# Altium schematic sheet Solenoid and Flasher Driver.SchDoc
size A3 portrait; Organization: Altium Limited; Address1: L3, 12a Rodborough Rd; Address2: Frenchs Forest; Address3: NSW; Address4: Australia 2086
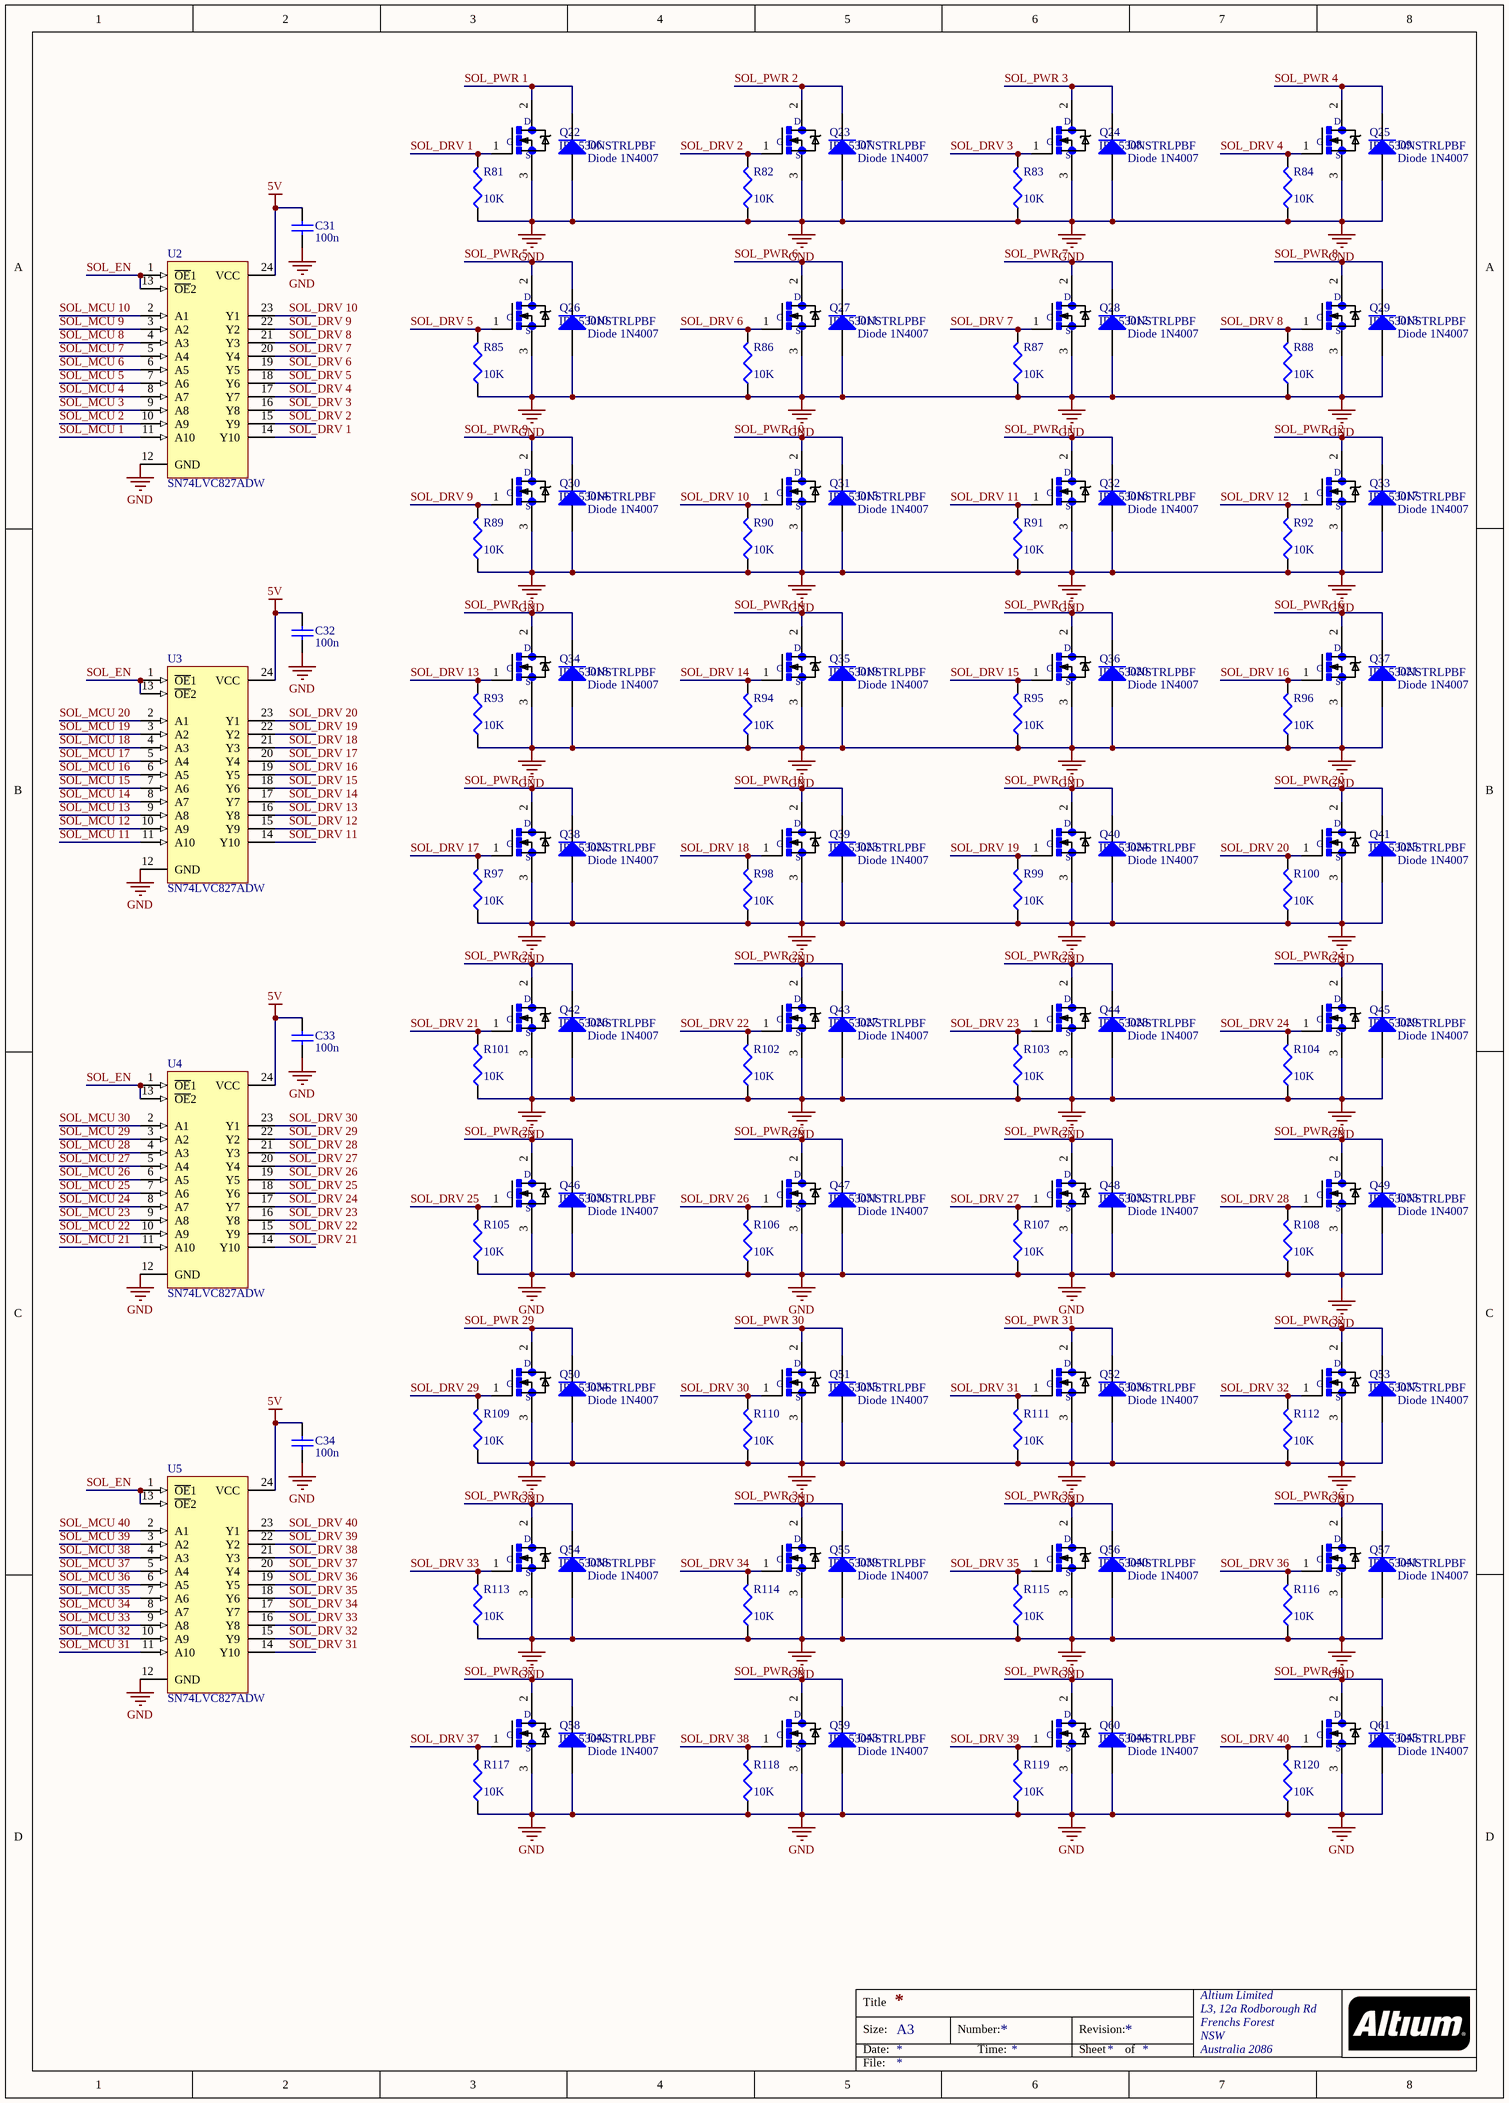
[diagram p0: Solenoid and Flasher Driver.SchDoc]

## Parts
C31  value 100n  [0805C-GENERIC]  (hidden comment: Cap Semi)
C32  value 100n  [0805C-GENERIC]  (hidden comment: Cap Semi)
C33  value 100n  [0805C-GENERIC]  (hidden comment: Cap Semi)
C34  value 100n  [0805C-GENERIC]  (hidden comment: Cap Semi)
D6  Diode 1N4007  [DO-41]
D7  Diode 1N4007  [DO-41]
D8  Diode 1N4007  [DO-41]
D9  Diode 1N4007  [DO-41]
D10  Diode 1N4007  [DO-41]
D11  Diode 1N4007  [DO-41]
D12  Diode 1N4007  [DO-41]
D13  Diode 1N4007  [DO-41]
D14  Diode 1N4007  [DO-41]
D15  Diode 1N4007  [DO-41]
D16  Diode 1N4007  [DO-41]
D17  Diode 1N4007  [DO-41]
D18  Diode 1N4007  [DO-41]
D19  Diode 1N4007  [DO-41]
D20  Diode 1N4007  [DO-41]
D21  Diode 1N4007  [DO-41]
D22  Diode 1N4007  [DO-41]
D23  Diode 1N4007  [DO-41]
D24  Diode 1N4007  [DO-41]
D25  Diode 1N4007  [DO-41]
D26  Diode 1N4007  [DO-41]
D27  Diode 1N4007  [DO-41]
D28  Diode 1N4007  [DO-41]
D29  Diode 1N4007  [DO-41]
D30  Diode 1N4007  [DO-41]
D31  Diode 1N4007  [DO-41]
D32  Diode 1N4007  [DO-41]
D33  Diode 1N4007  [DO-41]
D34  Diode 1N4007  [DO-41]
D35  Diode 1N4007  [DO-41]
D36  Diode 1N4007  [DO-41]
D37  Diode 1N4007  [DO-41]
D38  Diode 1N4007  [DO-41]
D39  Diode 1N4007  [DO-41]
D40  Diode 1N4007  [DO-41]
D41  Diode 1N4007  [DO-41]
D42  Diode 1N4007  [DO-41]
D43  Diode 1N4007  [DO-41]
D44  Diode 1N4007  [DO-41]
D45  Diode 1N4007  [DO-41]
Q22  IRL530NSTRLPBF  [TO-220AB]
Q23  IRL530NSTRLPBF  [TO-220AB]
Q24  IRL530NSTRLPBF  [TO-220AB]
Q25  IRL530NSTRLPBF  [TO-220AB]
Q26  IRL530NSTRLPBF  [TO-220AB]
Q27  IRL530NSTRLPBF  [TO-220AB]
Q28  IRL530NSTRLPBF  [TO-220AB]
Q29  IRL530NSTRLPBF  [TO-220AB]
Q30  IRL530NSTRLPBF  [TO-220AB]
Q31  IRL530NSTRLPBF  [TO-220AB]
Q32  IRL530NSTRLPBF  [TO-220AB]
Q33  IRL530NSTRLPBF  [TO-220AB]
Q34  IRL530NSTRLPBF  [TO-220AB]
Q35  IRL530NSTRLPBF  [TO-220AB]
Q36  IRL530NSTRLPBF  [TO-220AB]
Q37  IRL530NSTRLPBF  [TO-220AB]
Q38  IRL530NSTRLPBF  [TO-220AB]
Q39  IRL530NSTRLPBF  [TO-220AB]
Q40  IRL530NSTRLPBF  [TO-220AB]
Q41  IRL530NSTRLPBF  [TO-220AB]
Q42  IRL530NSTRLPBF  [TO-220AB]
Q43  IRL530NSTRLPBF  [TO-220AB]
Q44  IRL530NSTRLPBF  [TO-220AB]
Q45  IRL530NSTRLPBF  [TO-220AB]
Q46  IRL530NSTRLPBF  [TO-220AB]
Q47  IRL530NSTRLPBF  [TO-220AB]
Q48  IRL530NSTRLPBF  [TO-220AB]
Q49  IRL530NSTRLPBF  [TO-220AB]
Q50  IRL530NSTRLPBF  [TO-220AB]
Q51  IRL530NSTRLPBF  [TO-220AB]
Q52  IRL530NSTRLPBF  [TO-220AB]
Q53  IRL530NSTRLPBF  [TO-220AB]
Q54  IRL530NSTRLPBF  [TO-220AB]
Q55  IRL530NSTRLPBF  [TO-220AB]
Q56  IRL530NSTRLPBF  [TO-220AB]
Q57  IRL530NSTRLPBF  [TO-220AB]
Q58  IRL530NSTRLPBF  [TO-220AB]
Q59  IRL530NSTRLPBF  [TO-220AB]
Q60  IRL530NSTRLPBF  [TO-220AB]
Q61  IRL530NSTRLPBF  [TO-220AB]
R81  value 10K  [0805R-GENERIC]  (hidden comment: Res3)
R82  value 10K  [0805R-GENERIC]  (hidden comment: Res3)
R83  value 10K  [0805R-GENERIC]  (hidden comment: Res3)
R84  value 10K  [0805R-GENERIC]  (hidden comment: Res3)
R85  value 10K  [0805R-GENERIC]  (hidden comment: Res3)
R86  value 10K  [0805R-GENERIC]  (hidden comment: Res3)
R87  value 10K  [0805R-GENERIC]  (hidden comment: Res3)
R88  value 10K  [0805R-GENERIC]  (hidden comment: Res3)
R89  value 10K  [0805R-GENERIC]  (hidden comment: Res3)
R90  value 10K  [0805R-GENERIC]  (hidden comment: Res3)
R91  value 10K  [0805R-GENERIC]  (hidden comment: Res3)
R92  value 10K  [0805R-GENERIC]  (hidden comment: Res3)
R93  value 10K  [0805R-GENERIC]  (hidden comment: Res3)
R94  value 10K  [0805R-GENERIC]  (hidden comment: Res3)
R95  value 10K  [0805R-GENERIC]  (hidden comment: Res3)
R96  value 10K  [0805R-GENERIC]  (hidden comment: Res3)
R97  value 10K  [0805R-GENERIC]  (hidden comment: Res3)
R98  value 10K  [0805R-GENERIC]  (hidden comment: Res3)
R99  value 10K  [0805R-GENERIC]  (hidden comment: Res3)
R100  value 10K  [0805R-GENERIC]  (hidden comment: Res3)
R101  value 10K  [0805R-GENERIC]  (hidden comment: Res3)
R102  value 10K  [0805R-GENERIC]  (hidden comment: Res3)
R103  value 10K  [0805R-GENERIC]  (hidden comment: Res3)
R104  value 10K  [0805R-GENERIC]  (hidden comment: Res3)
R105  value 10K  [0805R-GENERIC]  (hidden comment: Res3)
R106  value 10K  [0805R-GENERIC]  (hidden comment: Res3)
R107  value 10K  [0805R-GENERIC]  (hidden comment: Res3)
R108  value 10K  [0805R-GENERIC]  (hidden comment: Res3)
R109  value 10K  [0805R-GENERIC]  (hidden comment: Res3)
R110  value 10K  [0805R-GENERIC]  (hidden comment: Res3)
R111  value 10K  [0805R-GENERIC]  (hidden comment: Res3)
R112  value 10K  [0805R-GENERIC]  (hidden comment: Res3)
R113  value 10K  [0805R-GENERIC]  (hidden comment: Res3)
R114  value 10K  [0805R-GENERIC]  (hidden comment: Res3)
R115  value 10K  [0805R-GENERIC]  (hidden comment: Res3)
R116  value 10K  [0805R-GENERIC]  (hidden comment: Res3)
R117  value 10K  [0805R-GENERIC]  (hidden comment: Res3)
R118  value 10K  [0805R-GENERIC]  (hidden comment: Res3)
R119  value 10K  [0805R-GENERIC]  (hidden comment: Res3)
R120  value 10K  [0805R-GENERIC]  (hidden comment: Res3)
U2  SN74LVC827ADW  [SOIC24]
U3  SN74LVC827ADW  [SOIC24]
U4  SN74LVC827ADW  [SOIC24]
U5  SN74LVC827ADW  [SOIC24]

## Nets
5V: C31.2 C32.2 C33.2 C34.2 U2.24(VCC) U3.24(VCC) U4.24(VCC) U5.24(VCC)
GND: C31.1 C32.1 C33.1 C34.1 D6.1(A) D7.1(A) D8.1(A) D9.1(A) D10.1(A) D11.1(A) D12.1(A) D13.1(A) D14.1(A) D15.1(A) D16.1(A) D17.1(A) D18.1(A) D19.1(A) D20.1(A) D21.1(A) D22.1(A) D23.1(A) D24.1(A) D25.1(A) D26.1(A) D27.1(A) D28.1(A) D29.1(A) D30.1(A) D31.1(A) D32.1(A) D33.1(A) D34.1(A) D35.1(A) D36.1(A) D37.1(A) D38.1(A) D39.1(A) D40.1(A) D41.1(A) D42.1(A) D43.1(A) D44.1(A) D45.1(A) Q22.3(S) Q23.3(S) Q24.3(S) Q25.3(S) Q26.3(S) Q27.3(S) Q28.3(S) Q29.3(S) Q30.3(S) Q31.3(S) Q32.3(S) Q33.3(S) Q34.3(S) Q35.3(S) Q36.3(S) Q37.3(S) Q38.3(S) Q39.3(S) Q40.3(S) Q41.3(S) Q42.3(S) Q43.3(S) Q44.3(S) Q45.3(S) Q46.3(S) Q47.3(S) Q48.3(S) Q49.3(S) Q50.3(S) Q51.3(S) Q52.3(S) Q53.3(S) Q54.3(S) Q55.3(S) Q56.3(S) Q57.3(S) Q58.3(S) Q59.3(S) Q60.3(S) Q61.3(S) R81.1 R82.1 R83.1 R84.1 R85.1 R86.1 R87.1 R88.1 R89.1 R90.1 R91.1 R92.1 R93.1 R94.1 R95.1 R96.1 R97.1 R98.1 R99.1 R100.1 R101.1 R102.1 R103.1 R104.1 R105.1 R106.1 R107.1 R108.1 R109.1 R110.1 R111.1 R112.1 R113.1 R114.1 R115.1 R116.1 R117.1 R118.1 R119.1 R120.1 U2.12(GND) U3.12(GND) U4.12(GND) U5.12(GND)
SOL_DRV 1: Q22.1(G) R81.2 U2.14(Y10)
SOL_DRV 2: Q23.1(G) R82.2 U2.15(Y9)
SOL_DRV 3: Q24.1(G) R83.2 U2.16(Y8)
SOL_DRV 4: Q25.1(G) R84.2 U2.17(Y7)
SOL_DRV 5: Q26.1(G) R85.2 U2.18(Y6)
SOL_DRV 6: Q27.1(G) R86.2 U2.19(Y5)
SOL_DRV 7: Q28.1(G) R87.2 U2.20(Y4)
SOL_DRV 8: Q29.1(G) R88.2 U2.21(Y3)
SOL_DRV 9: Q30.1(G) R89.2 U2.22(Y2)
SOL_DRV 10: Q31.1(G) R90.2 U2.23(Y1)
SOL_DRV 11: Q32.1(G) R91.2 U3.14(Y10)
SOL_DRV 12: Q33.1(G) R92.2 U3.15(Y9)
SOL_DRV 13: Q34.1(G) R93.2 U3.16(Y8)
SOL_DRV 14: Q35.1(G) R94.2 U3.17(Y7)
SOL_DRV 15: Q36.1(G) R95.2 U3.18(Y6)
SOL_DRV 16: Q37.1(G) R96.2 U3.19(Y5)
SOL_DRV 17: Q38.1(G) R97.2 U3.20(Y4)
SOL_DRV 18: Q39.1(G) R98.2 U3.21(Y3)
SOL_DRV 19: Q40.1(G) R99.2 U3.22(Y2)
SOL_DRV 20: Q41.1(G) R100.2 U3.23(Y1)
SOL_DRV 21: Q42.1(G) R101.2 U4.14(Y10)
SOL_DRV 22: Q43.1(G) R102.2 U4.15(Y9)
SOL_DRV 23: Q44.1(G) R103.2 U4.16(Y8)
SOL_DRV 24: Q45.1(G) R104.2 U4.17(Y7)
SOL_DRV 25: Q46.1(G) R105.2 U4.18(Y6)
SOL_DRV 26: Q47.1(G) R106.2 U4.19(Y5)
SOL_DRV 27: Q48.1(G) R107.2 U4.20(Y4)
SOL_DRV 28: Q49.1(G) R108.2 U4.21(Y3)
SOL_DRV 29: Q50.1(G) R109.2 U4.22(Y2)
SOL_DRV 30: Q51.1(G) R110.2 U4.23(Y1)
SOL_DRV 31: Q52.1(G) R111.2 U5.14(Y10)
SOL_DRV 32: Q53.1(G) R112.2 U5.15(Y9)
SOL_DRV 33: Q54.1(G) R113.2 U5.16(Y8)
SOL_DRV 34: Q55.1(G) R114.2 U5.17(Y7)
SOL_DRV 35: Q56.1(G) R115.2 U5.18(Y6)
SOL_DRV 36: Q57.1(G) R116.2 U5.19(Y5)
SOL_DRV 37: Q58.1(G) R117.2 U5.20(Y4)
SOL_DRV 38: Q59.1(G) R118.2 U5.21(Y3)
SOL_DRV 39: Q60.1(G) R119.2 U5.22(Y2)
SOL_DRV 40: Q61.1(G) R120.2 U5.23(Y1)
SOL_EN: U2.1(~{OE}1) U2.13(~{OE}2) U3.1(~{OE}1) U3.13(~{OE}2) U4.1(~{OE}1) U4.13(~{OE}2) U5.1(~{OE}1) U5.13(~{OE}2)
SOL_MCU 1: U2.11(A10)
SOL_MCU 2: U2.10(A9)
SOL_MCU 3: U2.9(A8)
SOL_MCU 4: U2.8(A7)
SOL_MCU 5: U2.7(A6)
SOL_MCU 6: U2.6(A5)
SOL_MCU 7: U2.5(A4)
SOL_MCU 8: U2.4(A3)
SOL_MCU 9: U2.3(A2)
SOL_MCU 10: U2.2(A1)
SOL_MCU 11: U3.11(A10)
SOL_MCU 12: U3.10(A9)
SOL_MCU 13: U3.9(A8)
SOL_MCU 14: U3.8(A7)
SOL_MCU 15: U3.7(A6)
SOL_MCU 16: U3.6(A5)
SOL_MCU 17: U3.5(A4)
SOL_MCU 18: U3.4(A3)
SOL_MCU 19: U3.3(A2)
SOL_MCU 20: U3.2(A1)
SOL_MCU 21: U4.11(A10)
SOL_MCU 22: U4.10(A9)
SOL_MCU 23: U4.9(A8)
SOL_MCU 24: U4.8(A7)
SOL_MCU 25: U4.7(A6)
SOL_MCU 26: U4.6(A5)
SOL_MCU 27: U4.5(A4)
SOL_MCU 28: U4.4(A3)
SOL_MCU 29: U4.3(A2)
SOL_MCU 30: U4.2(A1)
SOL_MCU 31: U5.11(A10)
SOL_MCU 32: U5.10(A9)
SOL_MCU 33: U5.9(A8)
SOL_MCU 34: U5.8(A7)
SOL_MCU 35: U5.7(A6)
SOL_MCU 36: U5.6(A5)
SOL_MCU 37: U5.5(A4)
SOL_MCU 38: U5.4(A3)
SOL_MCU 39: U5.3(A2)
SOL_MCU 40: U5.2(A1)
SOL_PWR 1: D6.2(K) Q22.2(D)
SOL_PWR 2: D7.2(K) Q23.2(D)
SOL_PWR 3: D8.2(K) Q24.2(D)
SOL_PWR 4: D9.2(K) Q25.2(D)
SOL_PWR 5: D10.2(K) Q26.2(D)
SOL_PWR 6: D11.2(K) Q27.2(D)
SOL_PWR 7: D12.2(K) Q28.2(D)
SOL_PWR 8: D13.2(K) Q29.2(D)
SOL_PWR 9: D14.2(K) Q30.2(D)
SOL_PWR 10: D15.2(K) Q31.2(D)
SOL_PWR 11: D16.2(K) Q32.2(D)
SOL_PWR 12: D17.2(K) Q33.2(D)
SOL_PWR 13: D18.2(K) Q34.2(D)
SOL_PWR 14: D19.2(K) Q35.2(D)
SOL_PWR 15: D20.2(K) Q36.2(D)
SOL_PWR 16: D21.2(K) Q37.2(D)
SOL_PWR 17: D22.2(K) Q38.2(D)
SOL_PWR 18: D23.2(K) Q39.2(D)
SOL_PWR 19: D24.2(K) Q40.2(D)
SOL_PWR 20: D25.2(K) Q41.2(D)
SOL_PWR 21: D26.2(K) Q42.2(D)
SOL_PWR 22: D27.2(K) Q43.2(D)
SOL_PWR 23: D28.2(K) Q44.2(D)
SOL_PWR 24: D29.2(K) Q45.2(D)
SOL_PWR 25: D30.2(K) Q46.2(D)
SOL_PWR 26: D31.2(K) Q47.2(D)
SOL_PWR 27: D32.2(K) Q48.2(D)
SOL_PWR 28: D33.2(K) Q49.2(D)
SOL_PWR 29: D34.2(K) Q50.2(D)
SOL_PWR 30: D35.2(K) Q51.2(D)
SOL_PWR 31: D36.2(K) Q52.2(D)
SOL_PWR 32: D37.2(K) Q53.2(D)
SOL_PWR 33: D38.2(K) Q54.2(D)
SOL_PWR 34: D39.2(K) Q55.2(D)
SOL_PWR 35: D40.2(K) Q56.2(D)
SOL_PWR 36: D41.2(K) Q57.2(D)
SOL_PWR 37: D42.2(K) Q58.2(D)
SOL_PWR 38: D43.2(K) Q59.2(D)
SOL_PWR 39: D44.2(K) Q60.2(D)
SOL_PWR 40: D45.2(K) Q61.2(D)

## Notes on the sheet
- Title
- Size:
- Date:
- A3
- Number:
- Time:
- Revision:
- Sheet
- of
- File:

## Library data of the parts
C31-C34 = Cap Semi: Capacitor (Semiconductor SIM Model); Published: 8-Jun-2000; LatestRevisionDate: 29-May-2009; LatestRevisionNote: IPC-7351 Footprint Added.; PackageReference: C1206; Publisher: Altium Limited; PackageDescription: Chip Capacitor
D6-D45 = Diode 1N4007: 1 Amp General Purpose Rectifier; Published: 8-Jun-2000; LatestRevisionDate: 17-Jul-2002; LatestRevisionNote: Re-released for DXP Platform.; DatasheetVersion: 1998; PackageVersion: Aug-1999; PackageReference: DO-41; Publisher: Altium Limited; PackageDescription: Diode, Axial; Body 5.2 x 2.7 mm (LxDia. max), Lead Dia. 0.86 mm (max); Code_JEDEC: DO-204-AL; ComponentLink1Description: Manufacturer Link; ComponentLink1URL: http://www.fairchildsemi.com/; ComponentLink2Description: Datasheet; ComponentLink2URL: http://www.fairchildsemi.com/ds/1N%2F1N4001.pdf
Q22-Q61 = IRL530NSTRLPBF: MOSFET N-CH 100V 17A D2PAK; MF: Infineon; Price: 0.79 USD; Package: D2PAK Infineon; Availability: Good; MP: IRL530NSTRLPBF; Value: *
R81-R120 = Res3: Resistor; Published: 8-Jun-2000; LatestRevisionDate: 29-May-2009; LatestRevisionNote: IPC-7351 Footprint Added.; PackageReference: J1-0603; Publisher: Altium Limited; PackageDescription: Chip Resistor
U2-U5 = SN74LVC827ADW: 10-Bit Buffer/Driver with 3-State Outputs; Published: 8-Jun-2000; LatestRevisionDate: 13-Apr-2006; LatestRevisionNote: IPC-7351 Footprint Added.; DatasheetVersion: Jun-1998; PackageVersion: Mar-2000; PackageReference: DW024; Publisher: Altium Limited; PackageDescription: 24-Pin Plastic Small Outline Integrated Circuit 1.27 mm Pitch; Code_JEDEC: MS-013; ComponentLink1Description: Manufacturer Link; ComponentLink1URL: http://www.ti.com/; ComponentLink2Description: Datasheet; ComponentLink2URL: http://www-s.ti.com/sc/ds/sn74lvc827a.pdf